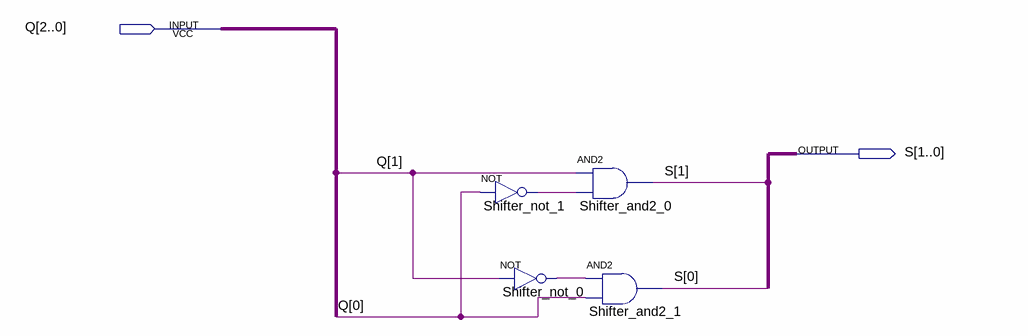
[diagram p0: schematic sheet]
// Quartus schematic S_Shifter.bdf as structural Verilog: 4 symbols, 2 pins
module S_Shifter (
  input  [2:0] Q,
  output [1:0] S
);

  wire Shifter_not_0_out, Shifter_not_1_out;

  not Shifter_not_1 (Shifter_not_1_out, Q[0]);
  not Shifter_not_0 (Shifter_not_0_out, Q[1]);
  and Shifter_and2_0 (S[1], Q[1], Shifter_not_1_out);
  and Shifter_and2_1 (S[0], Shifter_not_0_out, Q[0]);
endmodule
